# Altium project AFT05MS004.PrjPcb
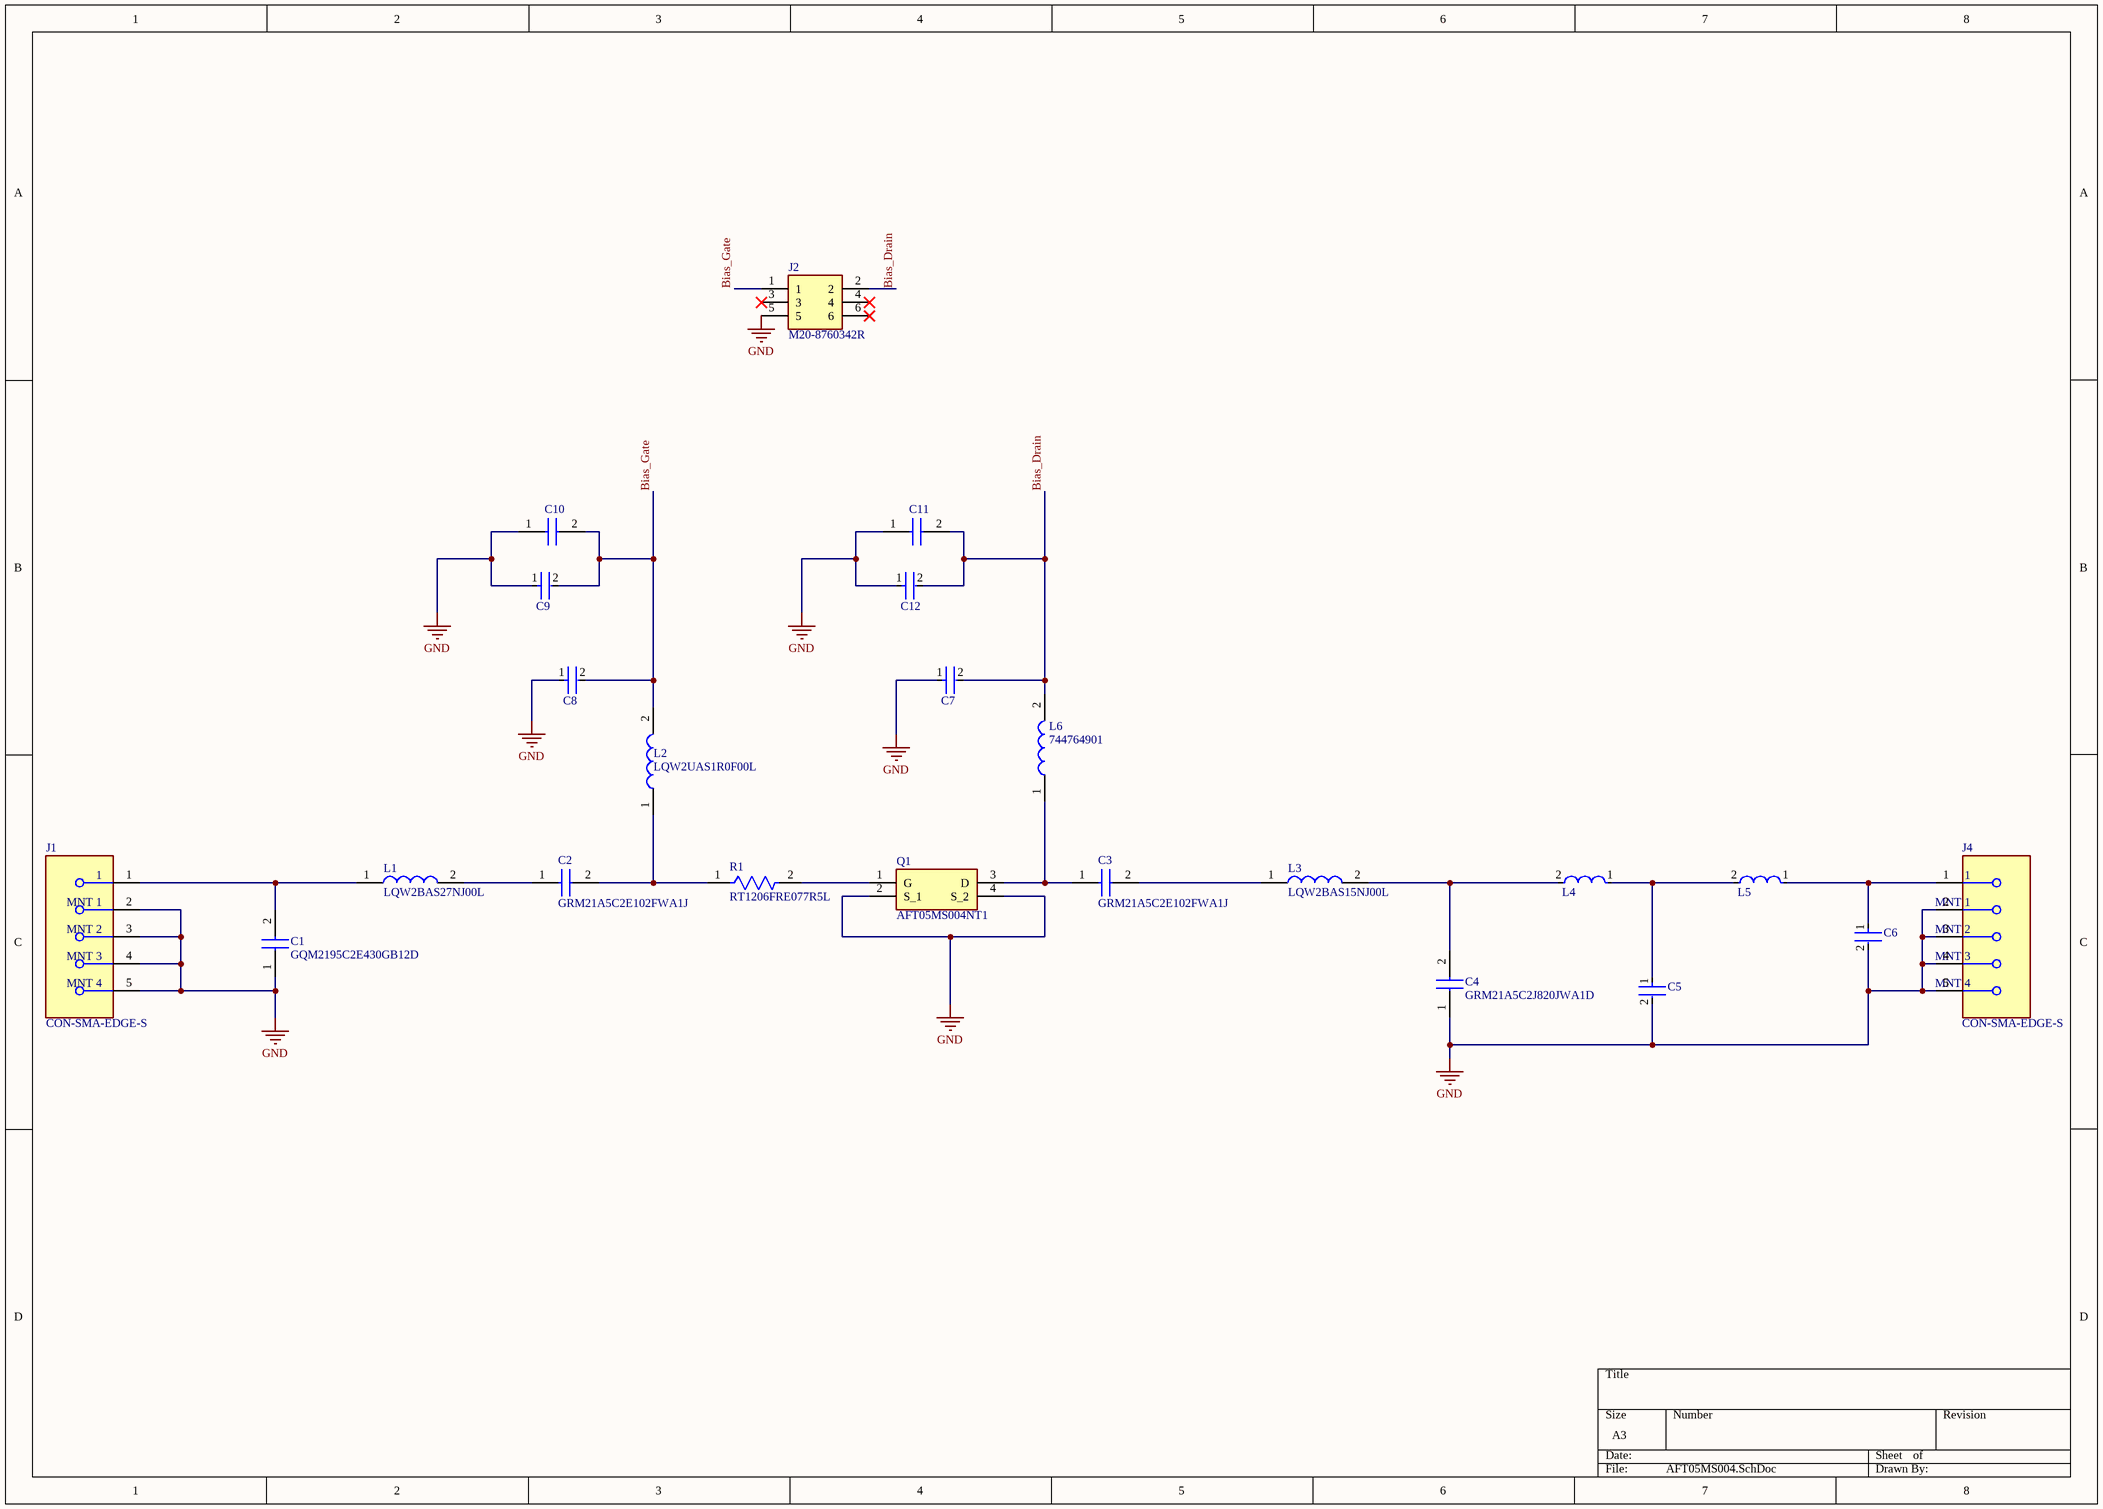
[diagram p0: AFT05MS004.SchDoc]
1 sheet, 23 parts. Net scope: global (net labels, ports and power ports of the same name join across sheets).
Board file: AFT05MS004.PcbDoc

## Sheet AFT05MS004.SchDoc
size A3

### Parts
C1  GQM2195C2E430GB12D  [GQM2195C2E100GB12D]
C2  GRM21A5C2E102FWA1J  [GRM21x]
C3  GRM21A5C2E102FWA1J  [GRM21x]
C4  GRM21A5C2J820JWA1D  [GRM21x]
C5  GRM21A5C2E390FW01D  [FP-GRM21A-0_2-MFG]  (value not drawn)
C6  GQM2195C2E300GB12D  [FP-GRM21A-0_2-MFG]  (value not drawn)
C7  GQM2195C2E300GB12D  [FP-GRM21A-0_2-MFG]  (value not drawn)
C8  GQM2195C2E300GB12D  [FP-GRM21A-0_2-MFG]  (value not drawn)
C9  GRM21A5C2E102FWA1J  [FP-GRM21A-0_2-MFG]  (value not drawn)
C10  GJ821BR71H105KA12K  [CAPC2012X135N]  (value not drawn)
C11  GJ821BR71H105KA12K  [CAPC2012X135N]  (value not drawn)
C12  GRM21A5C2E102FWA1J  [FP-GRM21A-0_2-MFG]  (value not drawn)
J1  CON-SMA-EDGE-S  [FP-CON-SMA-EDGE-S-MFG]
J2  M20-8760342R  [M208760342R]
J4  CON-SMA-EDGE-S  [FP-CON-SMA-EDGE-S-MFG]
L1  LQW2BAS27NJ00L  [LQW2BAN11NG00L]
L2  LQW2UAS1R0F00L  [LQW2UAS12NG00L]
L3  LQW2BAS15NJ00L  [LQW2BAN11NG00L]
L4  LQW2BAS56NG00L  [FP-LQW2BAN_00-MFG]  (value not drawn)
L5  LQW2BAS56NG00L  [FP-LQW2BAN_00-MFG]  (value not drawn)
L6  744764901  [INDM3425X240N]
Q1  AFT05MS004NT1  [MMG38151BT1]
R1  RT1206FRE077R5L  [FP-RT1206-MFG]

### Nets
GND: C1.1 C4.1 C5.2 C6.2 C7.1 C8.1 C9.1 C10.1 C11.1 C12.1 J1.2(MNT_1) J1.3(MNT_2) J1.4(MNT_3) J1.5(MNT_4) J2.5 J4.2(MNT_1) J4.3(MNT_2) J4.4(MNT_3) J4.5(MNT_4) Q1.2(S_1) Q1.4(S_2)
Bias_Drain: C7.2 C11.2 C12.2 J2.2 L6.2
Bias_Gate: C8.2 C9.2 C10.2 J2.1 L2.2
NetC1_2: C1.2 J1.1 L1.1
NetC2_1: C2.1 L1.2
NetC2_2: C2.2 L2.1 R1.1
NetC3_1: C3.1 L6.1 Q1.3(D)
NetC3_2: C3.2 L3.1
NetC4_2: C4.2 L3.2 L4.2
NetC5_1: C5.1 L4.1 L5.2
NetC6_1: C6.1 J4.1 L5.1
NetQ1_1: Q1.1(G) R1.2

Not connected (* = marked no-connect by the designer): J2 3* 4* 6*

### Library data of the parts
C1 = GQM2195C2E430GB12D: Capacitor; Manufacturer_Name: Murata Electronics; Datasheet Link: https://psearch.en.murata.com/capacitor/product/GQM2195C2E430GB12%23.html; Height: 1mm; Manufacturer_Part_Number: GQM2195C2E430GB12D
C2 C3 = GRM21A5C2E102FWA1J: Capacitor; Manufacturer_Name: Murata Electronics; Datasheet Link: https://search.murata.co.jp/Ceramy/image/img/A01X/G101/ENG/GRM21A5C2E102FWA1-01.pdf; Height: 1.25mm; Manufacturer_Part_Number: GRM21A5C2E102FWA1J; Mouser Part Number: 81-GRM21A5C2E102FWA1; Mouser Price/Stock: https://www.mouser.co.uk/ProductDetail/Murata-Electronics/GRM21A5C2E102FWA1J?qs=81r%252BiQLm7BQ9LqoY9FDtCA%3D%3D
C4 = GRM21A5C2J820JWA1D: Capacitor; Manufacturer_Name: Murata Electronics; Datasheet Link: https://search.murata.co.jp/Ceramy/image/img/A01X/G101/ENG/GRM21A5C2J820JWA1-01.pdf; Height: 1.25mm; Manufacturer_Part_Number: GRM21A5C2J820JWA1D
C5-C9 C12 = CMP-06035-012030-1: Chip Multilayer Ceramic Capacitors for General Purpose, 0805, 1000pF, C0G, 30ppm/°C, 1%, 250V
C10 C11 = GJ821BR71H105KA12K: Capacitor; Manufacturer_Name: Murata Electronics; Datasheet Link: https://www.mouser.it/datasheet/2/281/GJ821BR71H105KA12-01-1633769.pdf; Height: 1.35mm; Manufacturer_Part_Number: GJ821BR71H105KA12K; Mouser Part Number: 81-GJ821BR71H105KA2K; Mouser Price/Stock: https://www.mouser.co.uk/ProductDetail/Murata-Electronics/GJ821BR71H105KA12K?qs=QzBtWTOodeUPH%252BEtzhwB2g%3D%3D
J1 J4 = CMP-204357-000001-1: CONN SMA JACK STR EDGE MNT; Manufacturer: RF Solutions Ltd.; Impedance: 50Ω; Conn Orientation: Right Angle; Is Female: yes; Number Of Contacts: 1; Frequency: 18GHz; Shielding: true; Category: Conn; ComponentLink2URL: https://www.rfsolutions.co.uk/downloads/1498648656DS-CON-EDGE-SMA-4.pdf; Octopart: https://octopart.com/con-sma-edge-s-rf+solutions-70967450; Package: CONN_JACK; Manufacturer Part Number: CON-SMA-EDGE-S; Height: 6.35mm; Device Class L1: Connectors; Footprint Url: https://forum.upverter.com/uploads/default/original/3X/b/e/be75b907af57498775929d6d9099689c472e0307.pdf; Contact Material: Gold; ComponentLink2Description: Datasheet; Device Class L2: RF / Coaxial Connectors; RoHS: TRUE; Device Class L3: unset; Digikey Description: CONN SMA JACK STR EDGE MNT; Lead Free: Yes; Automotive: No
J2 = M20-8760342R: Connector; Manufacturer_Name: Harwin; Datasheet Link: https://cdn.harwin.com/pdfs/M20-876R.pdf; Height: 11.5mm; Manufacturer_Part_Number: M20-8760342R; Mouser Part Number: 855-M20-8760342R; Mouser Price/Stock: https://www.mouser.co.uk/ProductDetail/Harwin/M20-8760342R?qs=vF78I%252BjhbY%2F5VOL01aBOqA%3D%3D
L1 = LQW2BAS27NJ00L: Inductor; Manufacturer_Name: Murata Electronics; Datasheet Link: https://psearch.en.murata.com/inductor/product/LQW2BAS27NJ00%23.html; Height: 1.52mm; Manufacturer_Part_Number: LQW2BAS27NJ00L; Mouser Part Number: 81-LQW2BAS27NJ00L; Mouser Price/Stock: https://www.mouser.com/Search/Refine.aspx?Keyword=81-LQW2BAS27NJ00L
L2 = LQW2UAS1R0F00L: Inductor; Manufacturer_Name: Murata Electronics; Datasheet Link: https://psearch.en.murata.com/inductor/product/LQW2UAS1R0F00%23.html; Height: 2.03mm; Manufacturer_Part_Number: LQW2UAS1R0F00L; Mouser Part Number: 81-LQW2UAS1R0F00L; Mouser Price/Stock: https://www.mouser.co.uk/ProductDetail/Murata-Electronics/LQW2UAS1R0F00L?qs=Mv7BduZupUgqoNE0G54YCQ%3D%3D; Arrow Part Number: LQW2UAS1R0F00L; Arrow Price/Stock: https://www.arrow.com/en/products/lqw2uas1r0f00l/murata-manufacturing
L3 = LQW2BAS18NJ00L: Inductor; Manufacturer_Name: Murata Electronics; Datasheet Link: https://psearch.en.murata.com/inductor/product/LQW2BAS18NJ00%23.html; Height: 1.52mm; Manufacturer_Part_Number: LQW2BAS18NJ00L; Mouser Part Number: 81-LQW2BAS18NJ00L; Mouser Price/Stock: https://www.mouser.co.uk/ProductDetail/Murata-Electronics/LQW2BAS18NJ00L?qs=XY81OjNnpal2Dbjq17m9Aw%3D%3D; Arrow Part Number: LQW2BAS18NJ00L; Arrow Price/Stock: https://www.arrow.com/en/products/lqw2bas18nj00l/murata-manufacturing
L4 L5 = CMP-06042-001883-1: Wire Wound RF Inductor 56nH ±2% 500mA 0.34Ω 0805 (2015); Shielding: Unshielded; DC Resistance (DCR): 340mR; Test Frequency: 200MHz; Self Resonant Frequency: 1.6GHz; Width: 0.06inch; Min Operating Temperature: -40°C; Inductance: 56nH; Mount: Surface Mount; Packaging: Tape and Reel; Resistor Type: Wirewound; Max Operating Temperature: 85°C; Package Quantity: 2000; Current Rating: 500mA; Case/Package: 0805; Length: 0.082inch; Height - Seated (Max): 0.061inch; Tolerance: 2%
L6 = 744764901: Inductor; Manufacturer_Name: Wurth Elektronik; Datasheet Link: https://www.we-online.com/catalog/datasheet/744764901.pdf; Height: 2.4mm; Manufacturer_Part_Number: 744764901; Mouser Part Number: 710-744764901; Mouser Price/Stock: https://www.mouser.com/Search/Refine.aspx?Keyword=710-744764901
Q1 = AFT05MS004NT1: MOSFET (N-Channel); Manufacturer_Name: NXP; Datasheet Link: http://www.nxp.com/docs/en/data-sheet/AFT05MS004N.pdf; Height: 1mm; Manufacturer_Part_Number: AFT05MS004NT1; Mouser Part Number: 841-AFT05MS004NT1; Mouser Price/Stock: https://www.mouser.co.uk/ProductDetail/NXP-Semiconductors/AFT05MS004NT1?qs=WBUF01kN13krUbpKnCYN3g%3D%3D; Arrow Part Number: AFT05MS004NT1; Arrow Price/Stock: https://www.arrow.com/en/products/aft05ms004nt1/nxp-semiconductors?region=nac
R1 = CMP-03412-009810-1: RES SMD 7.5 OHM 1% 1/4W 1206; Manufacturer: Yageo; Voltage Rating: 200V; Tolerance: 0.0002; Resistance: 7.5Ω; Value: 7.5Ω; Power Rating: 0.25W; Temperature Coefficient: 50 ppm/°C; Digikey Description: RES SMD 7.5 OHM 1% 1/4W 1206; Composition: Thin Film; Octopart: https://octopart.com/rt1206fre077r5l-yageo-71404764; Temperature Range High: +155°C; Manufacturer Part Number: RT1206FRE077R5L; Height: 0.65mm; Lead Free: Yes; Device Class L2: Resistors; ComponentLink2Description: Datasheet; Temperature Range Low: -55°C; ComponentLink2URL: http://www.yageo.com/documents/recent/PYu-RT_1-to-0.01_RoHS_L_9.pdf; Category: Res; RoHS: TRUE; Device Class L1: Passive Components; Temperature: -55°C to +155°C; Package: RT1206; Automotive: No; Series: RT; Device Class L3: Chip SMD Resistors; Footprint Url: http://www.yageo.com/exep/pages/download/literatures/PYu-R_Mount_10.pdf; Ipc Land Pattern Name: RESC310160X55